# EAGLE design esp8266-bme280-deepsleep (EAGLE 9.0.0)
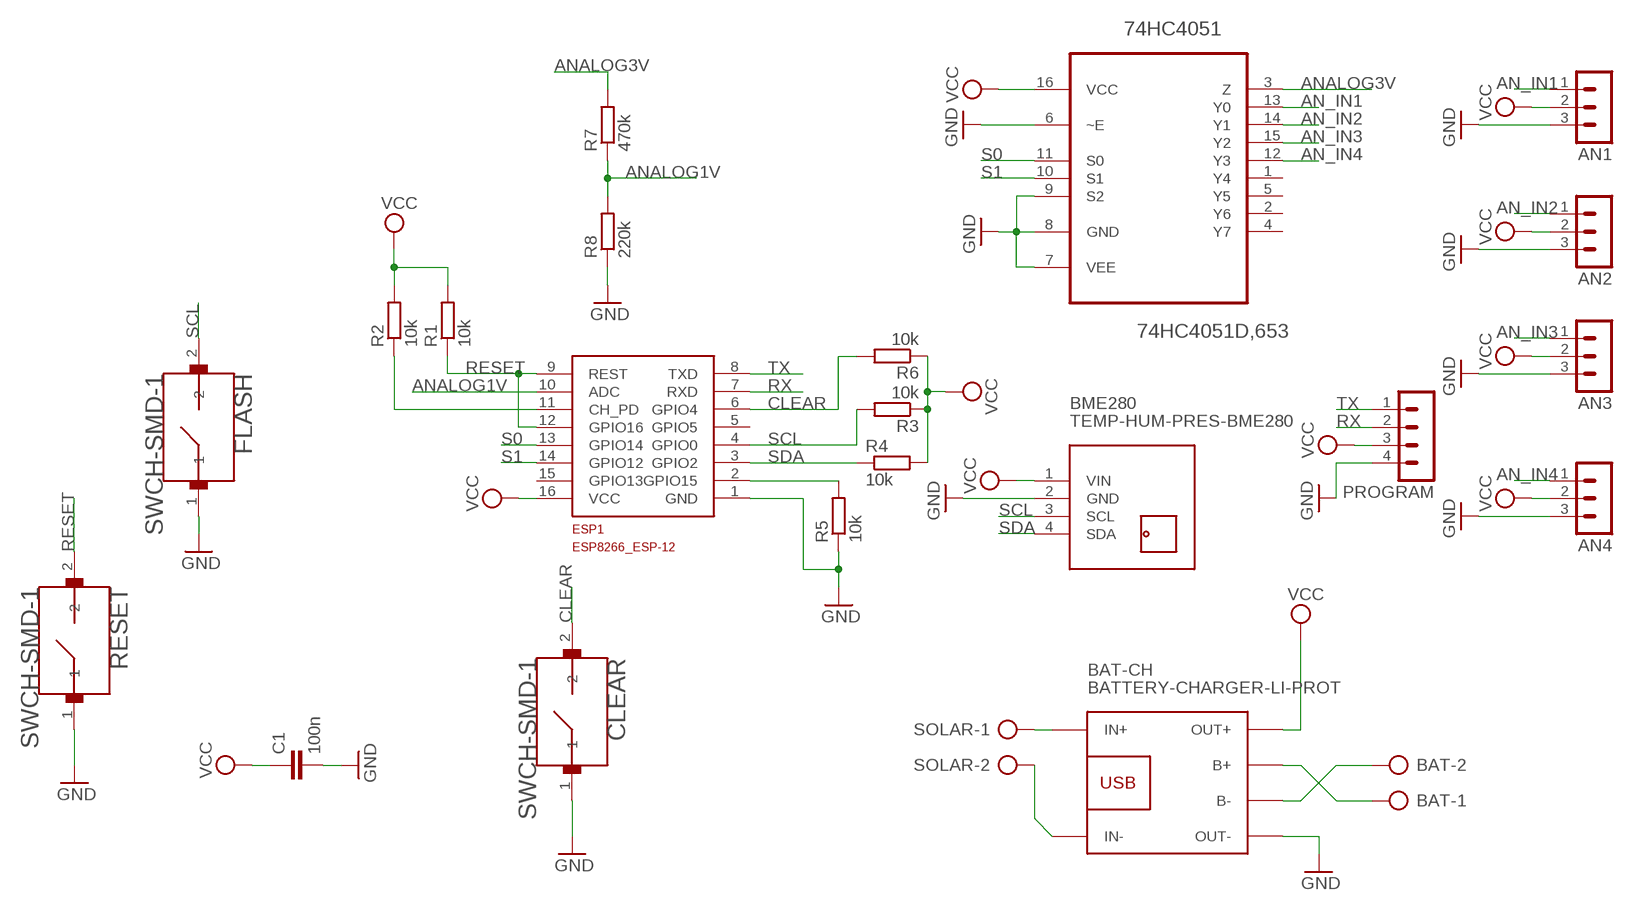
[diagram p0: schematic, sheet 1]

## Parts
74HC4051  74HC4051D,653  [SOIC127P600X175-16N]
AN1  MA03-1  [MA03-1]
AN2  MA03-1  [MA03-1]
AN3  MA03-1  [MA03-1]
AN4  MA03-1  [MA03-1]
BAT  PWR_CONN_KK  [PWR_CONN_KK_5MM]
BAT-CH  BATTERY-CHARGER-LI-PROT  [BATTERY-CHARGER-LI-PROT]
BME280  TEMP-HUM-PRES-BME280  [TEMP-HUM-PRES-BME280]
C1  100n  C2,5-3  [C2.5-3]
CLEAR  SWCH-SMD-1  [SWCH-SMD-1]
ESP1  ESP8266_ESP-12  [ESP8266-ESP12]
FLASH  SWCH-SMD-1  [SWCH-SMD-1]
PROGRAM  MA04-1  [MA04-1]
R1  10k  R-EU_0204/7  [0204/7]
R2  10k  R-EU_0204/7  [0204/7]
R3  10k  R-EU_0204/7  [0204/7]
R4  10k  R-EU_0204/7  [0204/7]
R5  10k  R-EU_0204/7  [0204/7]
R6  10k  R-EU_0204/7  [0204/7]
R7  470k  R-EU_0204/7  [0204/7]
R8  220k  R-EU_0204/7  [0204/7]
RESET  SWCH-SMD-1  [SWCH-SMD-1]
SOLAR  PWR_CONN_KK  [PWR_CONN_KK_5MM]

## Nets
AN_IN1: 74HC4051.13(Y0) AN1.1
AN_IN2: 74HC4051.14(Y1) AN2.1
AN_IN3: 74HC4051.15(Y2) AN3.1
AN_IN4: 74HC4051.12(Y3) AN4.1
ANALOG1V: ESP1.10(ADC) R7.1 R8.2
ANALOG3V: 74HC4051.3(Z) R7.2
CLEAR: CLEAR.2 ESP1.6(GPIO4) R6.2
GND: 74HC4051.6(~E) 74HC4051.7(VEE) 74HC4051.8(GND) 74HC4051.9(S2) AN1.3 AN2.3 AN3.3 AN4.3 BAT-CH.OUT- BME280.2(GND) C1.2 CLEAR.1 ESP1.1(GND) FLASH.1 PROGRAM.4 R5.1 R8.1 RESET.1
N$2: ESP1.11(CH_PD) R2.1
N$3: BAT-CH.B+ BAT.1
N$4: BAT-CH.B- BAT.2
N$6: BAT-CH.IN+ SOLAR.1
N$7: BAT-CH.IN- SOLAR.2
N$8: ESP1.2(GPIO15) R5.2
RESET: ESP1.9(REST) ESP1.12(GPIO16) R1.1 RESET.2
RX: ESP1.7(RXD) PROGRAM.2
S0: 74HC4051.11(S0) ESP1.13(GPIO14)
S1: 74HC4051.10(S1) ESP1.14(GPIO12)
SCL: BME280.3(SCL) ESP1.4(GPIO0) FLASH.2 R3.2
SDA: BME280.4(SDA) ESP1.3(GPIO2) R4.1
TX: ESP1.8(TXD) PROGRAM.1
VCC: 74HC4051.16(VCC) AN1.2 AN2.2 AN3.2 AN4.2 BAT-CH.OUT+ BME280.1(VIN) C1.1 ESP1.16(VCC) PROGRAM.3 R1.2 R2.2 R3.1 R4.2 R6.1
Unconnected: 74HC4051.1(Y4) 74HC4051.2(Y6) 74HC4051.4(Y7) 74HC4051.5(Y5) ESP1.5(GPIO5) ESP1.15(GPIO13)

## Library data of the parts
74HC4051 = 74HC4051D_653:74HC4051D,653: 8-channel analog multiplexer/demultiplexer; AVAILABILITY: Good; DESCRIPTION: 74HC Series 10V 8-Channel Analog Multiplexer/Demultiplexer - SOIC-16; MF: Nexperia; MP: 74HC4051D,653; PACKAGE: SO-16 Nexperia; PRICE: 0.16 USD
AN1-AN4 = con-lstb:MA03-1: PIN HEADER; OC_FARNELL: unknown; OC_NEWARK: unknown
BAT SOLAR = conn_pwr_kk:PWR_CONN_KK: CONNECTOR Aug. 2004 / PTR Meßtechnik: Die Bezeichnung der Serie AK505 wurde geändert. Es handelt sich hierbei um AK500 in horizontaler Ausführung.; OC_FARNELL: unknown; OC_NEWARK: unknown
BAT-CH = diy-modules:BATTERY-CHARGER-LI-PROT: Lithium Battery 5V Charger with protection circuit More details available here: http://www.instructables.com/id/DIY-Lithium-ion-Battery-Charger/step4/TP4056-based-lithium-ion-battery-charger-module/ Click here to find device on ebay.com <http://www.ebay.com/sch/tp4056+charger+usb+protection>
BME280 = diy-modules:TEMP-HUM-PRES-BME280: Digital Humidity-Temperature-Pressure Sensor based on BME280 device More information about BME280 device is available here: https://www.bosch-sensortec.com/bst/products/all_products/bme280 Click here to find device on ebay.com <http://www.ebay.com/sch/bme280+breakout>
C1 = capacitor-wima:C: CAPACITOR naming: grid - package width
CLEAR FLASH RESET = SMD-SWITCH-1:SWCH-SMD-1: Switch Tactile N.O. SPST Round Button Gull Wing 0.05A 12VDC 1.5N SMD Embossed T/R; AVAILABILITY: Good; DESCRIPTION: Switch Tactile N.O. SPST Round Button Gull Wing 0.05A 12VDC 1.5N SMD Embossed T/R; MF: Omron; MP: B3U-1000P; PACKAGE: None; PRICE: 0.67 USD
ESP1 = ESP8266-ESP12:ESP8266_ESP-12
PROGRAM = con-lstb:MA04-1: PIN HEADER; OC_FARNELL: unknown; OC_NEWARK: unknown
R1-R8 = resistor:R-EU_: RESISTOR, European symbol

## Board
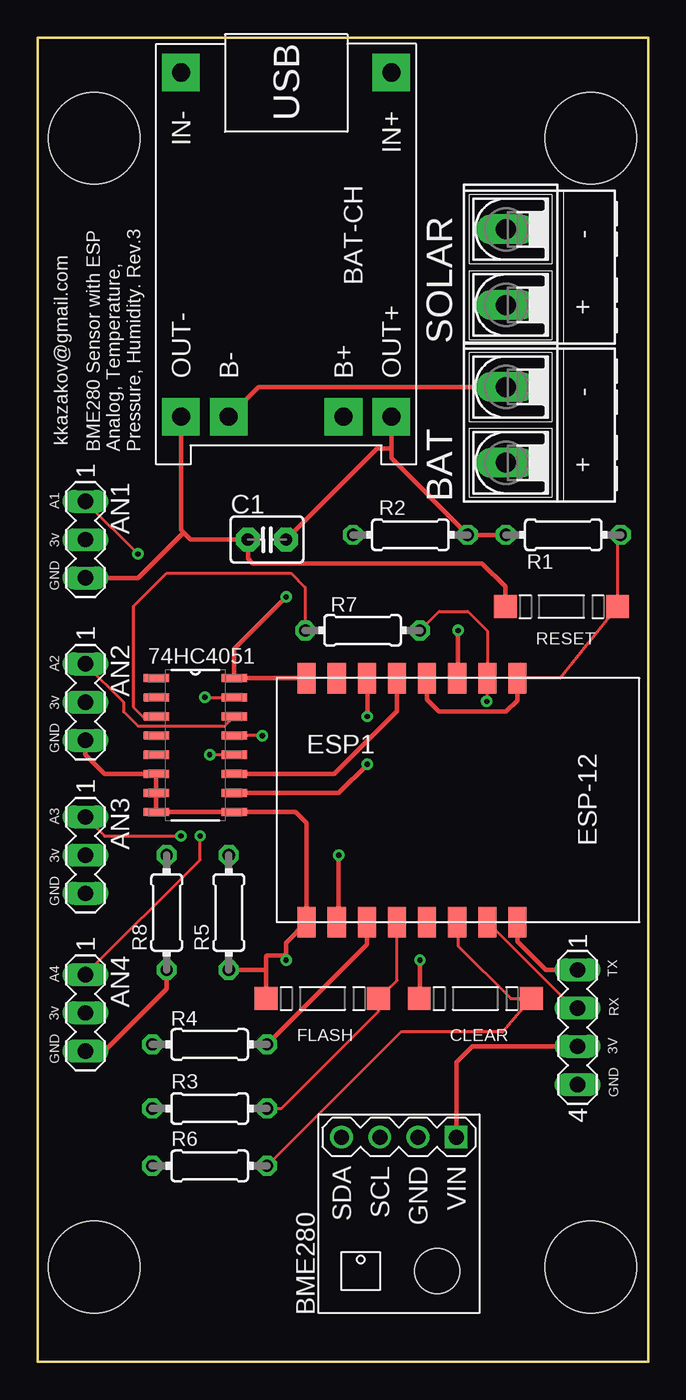
[diagram p1: board, top side]
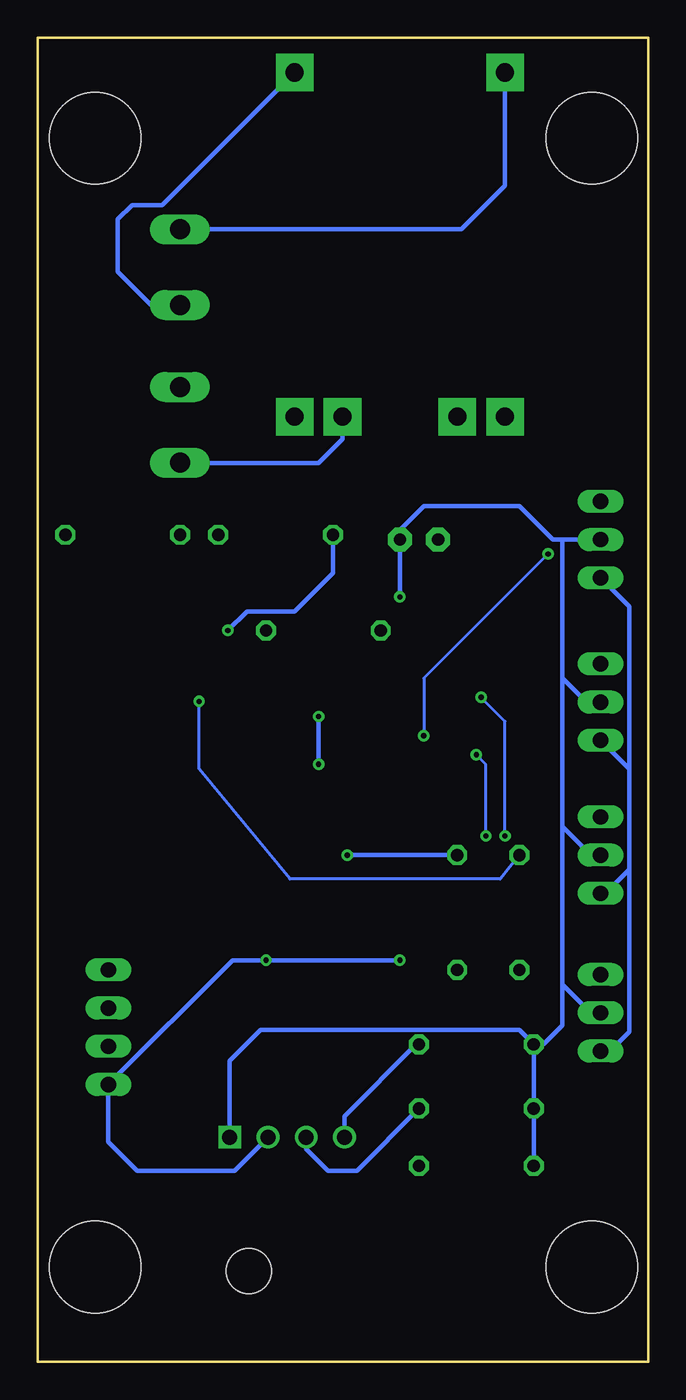
[diagram p2: board, bottom side, seen from below]

Size 40.58 x 87.95 mm. Coordinates in mm from the lower left corner, seen from the top.
Outline: 0,87.95 40.58,87.95 40.58,0 0,0 0,87.95
Copper layers (1*16): Top 0.035mm / dielectric 1.5mm / Bottom 0.035mm
Design rules "default": minimum track width 6mil, minimum drill 0.35mm, track to track 6mil, track to pad 6mil, pad to pad 6mil, via to via 6mil, smd to smd 6mil, copper to edge 40mil, drill to drill 6mil, minimum pad ring 10mil, minimum via ring 8mil, stop-mask expansion 4mil, vias tented up to drill 0mil, thermal gap 10mil
Holes 6.1 mm at 3.76,81.27 36.75,81.27 3.76,6.29 36.75,6.29

### Footprints (pad centres in the part's own frame; a part is rotated, then mirrored left to right if it is on the bottom)
SOIC127P600X175-16N = smd 1.702 x 0.533: 1 -2.591,4.445; 2 -2.591,3.175; 3 -2.591,1.905; 4 -2.591,0.635; 5 -2.591,-0.635; 6 -2.591,-1.905; 7 -2.591,-3.175; 8 -2.591,-4.445; 9 2.591,-4.445; 10 2.591,-3.175; 11 2.591,-1.905; 12 2.591,-0.635; 13 2.591,0.635; 14 2.591,1.905; 15 2.591,3.175; 16 2.591,4.445
MA03-1 = drill 1.016 long: 1 -2.54,0; 2 0,0; 3 2.54,0
PWR_CONN_KK_5MM = drill 1.321 long: 1 -2.515,0; 2 2.515,0
BATTERY-CHARGER-LI-PROT = drill 1.2 pad 2.5 square: B+ 10.795,3.81; B- 10.795,-3.81; IN+ -12.065,6.985; IN- -12.065,-6.985; OUT+ 10.795,6.985; OUT- 10.795,-6.985
TEMP-HUM-PRES-BME280 = drill 1 square: 1 -5.08,3.81 | drill 1: 2 -5.08,1.27; 3 -5.08,-1.27; 4 -5.08,-3.81 | hole 3: 3.81,2.54
C2.5-3 = drill 0.813 pad 1.6 octagon: 1 -1.27,0; 2 1.27,0
SWCH-SMD-1 = smd 1.524 x 1.524: 1 -3.224,0; 2 4.24,0
ESP8266-ESP12 = smd 2 x 1.2: 1 16.2,2; 2 16.2,4; 3 16.2,6; 4 16.2,8; 5 16.2,10; 6 16.2,12; 7 16.2,14; 8 16.2,16; 9 0,16; 10 0,14; 11 0,12; 12 0,10; 13 0,8; 14 0,6; 15 0,4; 16 0,2
MA04-1 = drill 1.016 long: 1 -3.81,0; 2 -1.27,0; 3 1.27,0; 4 3.81,0
0204/7 = drill 0.813 octagon: 1 -3.81,0; 2 3.81,0

### Placement (x,y rotation side)
74HC4051  10.48,40.96 0 top
AN1  3.18,54.61 270 top
AN2  3.18,43.81 270 top
AN3  3.18,33.66 270 top
AN4  3.18,23.18 270 top
BAT  31.12,62.23 90 top
BAT-CH  16.51,73.57 270 top
BME280  24,9.84 270 top
C1  15.24,54.61 180 top
CLEAR  28.58,24.13 0 top
ESP1  15.88,45.4 270 top
FLASH  18.41,24.13 0 top
PROGRAM  35.88,22.23 270 top
R1  34.92,54.93 180 top
R2  24.77,54.93 0 top
R3  11.43,16.83 0 top
R4  11.43,21.08 180 top
R5  12.7,29.85 90 top
R6  11.43,13.02 0 top
R7  21.59,48.58 180 top
R8  8.57,29.85 90 top
RESET  34.29,50.16 0 top
SOLAR  31.12,72.71 90 top

### Tracks (layer width: path | path; a pad name or v marks a point on that pad's centre or on a via)
AN_IN1  (via drill 0.35)
  Top 0.203: v14.92,41.59 74HC4051.13 | AN1.1 v6.67,53.66
  Bottom 0.203: v6.67,53.66 14.92,45.4 v14.92,41.59
AN_IN2
  Top 0.203: AN2.1 5.71,43.81 5.71,43.18 6.67,42.23 12.43,42.23 74HC4051.14
AN_IN3  (via drill 0.35)
  Top 0.203: AN3.1 4.45,34.92 v9.52,34.92 | v11.11,44.13 74HC4051.15
  Bottom 0.203: v9.52,34.92 9.52,42.55 v11.11,44.13
AN_IN4  (via drill 0.35)
  Top 0.203: AN4.1 10.8,33.34 v10.8,34.92 | v11.43,40.32 74HC4051.12
  Bottom 0.203: v10.8,34.92 10.8,39.69 v11.43,40.32
ANALOG1V  (via drill 0.35)
  Top 0.203: R7.1 26.67,49.85 28.58,49.85 29.88,48.55 ESP1.10 29.88,43.89 v29.84,43.86
  Bottom 0.203: R8.2 9.84,32.07 23.81,32.07 29.84,39.37 v29.84,43.86
ANALOG3V
  Top 0.203: 74HC4051.3 6.98,42.86 6.35,43.5 6.35,50.16 8.57,52.39 16.83,52.39 17.78,51.44 R7.2
CLEAR
  Top 0.203: R6.2 24.13,21.91 30.91,21.91 CLEAR.2 31.43,24.13 27.94,27.62 27.94,29.14 ESP1.6
GND  (via drill 0.35)
  Top 0.305: BAT-CH.OUT- 9.52,55.24 9.68,55.09 | 9.68,55.09 10.16,54.61 C1.2 13.97,53.34 14.29,53.02 29.53,53.02 31.07,51.48 RESET.1 | 17.67,29 ESP1.1 | ESP1.1 17.88,35.78 17.14,36.51 74HC4051.9 74HC4051.8 74HC4051.7 74HC4051.6 4.45,39.05 3.18,40.32 AN2.3 | AN1.3 6.67,52.07 9.68,55.09 | 17.78,29.11 ESP1.1 | v16.51,26.67 16.51,26.99 | 16.51,26.99 16.51,27.84 ESP1.1 | 16.51,26.99 15.24,26.99 15.19,26.94 15.19,26.03 | FLASH.1 15.19,26.03 | CLEAR.1 25.4,24.18 v25.4,26.67 | AN4.3 4.45,20.64 8.57,24.76 R8.1 | R5.1 15.19,26.03
  Bottom 0.305: 35.88,18.1 PROGRAM.4 | BME280.2 27.49,12.7 33.97,12.7 35.88,14.6 PROGRAM.4 | AN2.3 1.27,39.37 | 1.27,39.37 1.27,32.7 | 1.27,32.7 2.86,31.12 AN3.3 | AN1.3 1.27,50.16 1.27,39.37 | AN4.3 2.54,20.64 1.27,21.91 1.27,32.7 | PROGRAM.4 27.62,26.67 v25.4,26.67 v16.51,26.67
N$2  (via drill 0.35)
  Top 0.305: v27.94,48.58 27.94,45.47 ESP1.11
  Bottom 0.305: R2.1 20.95,52.39 23.49,49.85 26.67,49.85 v27.94,48.58
N$3
  Bottom 0.305: BAT-CH.B+ 20.32,61.28 21.91,59.69 31.09,59.69 BAT.1
N$4
  Top 0.305: BAT-CH.B- 14.67,64.74 BAT.2
N$6
  Bottom 0.305: BAT-CH.IN+ 32.29,76.84 34.29,76.84 35.24,75.88 35.24,72.39 33.05,70.19 SOLAR.1
N$7
  Bottom 0.305: BAT-CH.IN- 9.52,78.1 12.41,75.22 SOLAR.2
N$8  (via drill 0.35)
  Top 0.305: ESP1.2 20,29.33 v20,33.66
  Bottom 0.305: v20,33.66 R5.2
RESET
  Top 0.203: 32.07,45.4 34.72,45.4 RESET.2 38.53,54.5 38.85,54.81 | 32.07,45.4 ESP1.9 | 32.07,46.36 32.07,45.4
  Top 0.305: ESP1.9 31.88,43.94 31.12,43.18 26.67,43.18 25.88,43.98 ESP1.12 | 38.85,54.81 R1.1
RX
  Top 0.203: ESP1.7 35.58,23.5 PROGRAM.2
S0
  Top 0.305: 74HC4051.11 19.68,39.05 23.88,43.24 ESP1.13
S1  (via drill 0.35)
  Top 0.305: 74HC4051.10 20,37.78 v21.91,39.69 | v21.91,42.86 21.91,45.37 ESP1.14
  Bottom 0.305: v21.91,39.69 v21.91,42.86
SCL
  Top 0.203: ESP1.4 23.88,25.35 FLASH.2 22.66,23.29 16.19,16.83 R3.2
  Bottom 0.305: BME280.3 22.73,14.16 21.27,12.7 19.37,12.7 R3.2
SDA
  Top 0.305: R4.1 21.88,27.72 ESP1.3
  Bottom 0.305: BME280.4 20.19,16.32 15.43,21.08 R4.1
TX
  Top 0.305: PROGRAM.1 33.77,26.03 31.88,27.93 ESP1.8
VCC  (via drill 0.35)
  Top 0.305: PROGRAM.3 28.89,20.95 27.81,19.88 BME280.1 | BAT-CH.OUT+ 23.49,60.64 | 23.49,60.64 23.49,60.01 R2.2 R1.2 | C1.1 22.54,60.64 23.49,60.64 | ESP1.16 74HC4051.16 13.07,47.36 v16.51,50.8
  Bottom 0.305: R4.2 R3.1 R6.1 | BME280.1 27.81,20 25.77,22.05 8.59,22.05 R4.2 | AN1.2 5.71,54.61 | 5.71,54.61 6.35,54.61 8.57,56.83 14.92,56.83 16.51,55.24 C1.1 v16.51,50.8 | AN2.2 4.13,43.81 5.71,45.4 | 5.71,45.4 5.71,54.61 | AN3.2 3.81,33.66 5.71,35.56 | 5.71,35.56 5.71,45.4 | AN4.2 3.81,23.18 5.71,25.08 | 5.71,25.08 5.71,35.56 | 5.71,25.08 5.71,22.35 6.98,21.08 R4.2

### Text on the board
tNames: kkazakov@gmail.com | BME280 Sensor with ESP / Analog, Temperature, / Pressure, Humidity. Rev.3 | A1 | 3v | GND | A2 | 3v | GND | A3 | 3v | GND | A4 | TX | 3v | RX | 3V | GND | GND